# EasyEDA schematic LawnBot.json
TITLE: LawnBot Circuit Diagram; REV: 1.0; Date: 2025-03-28; Sheet: 1/1; Drawn By: Huy T Huong; Company: University of Bridgeport
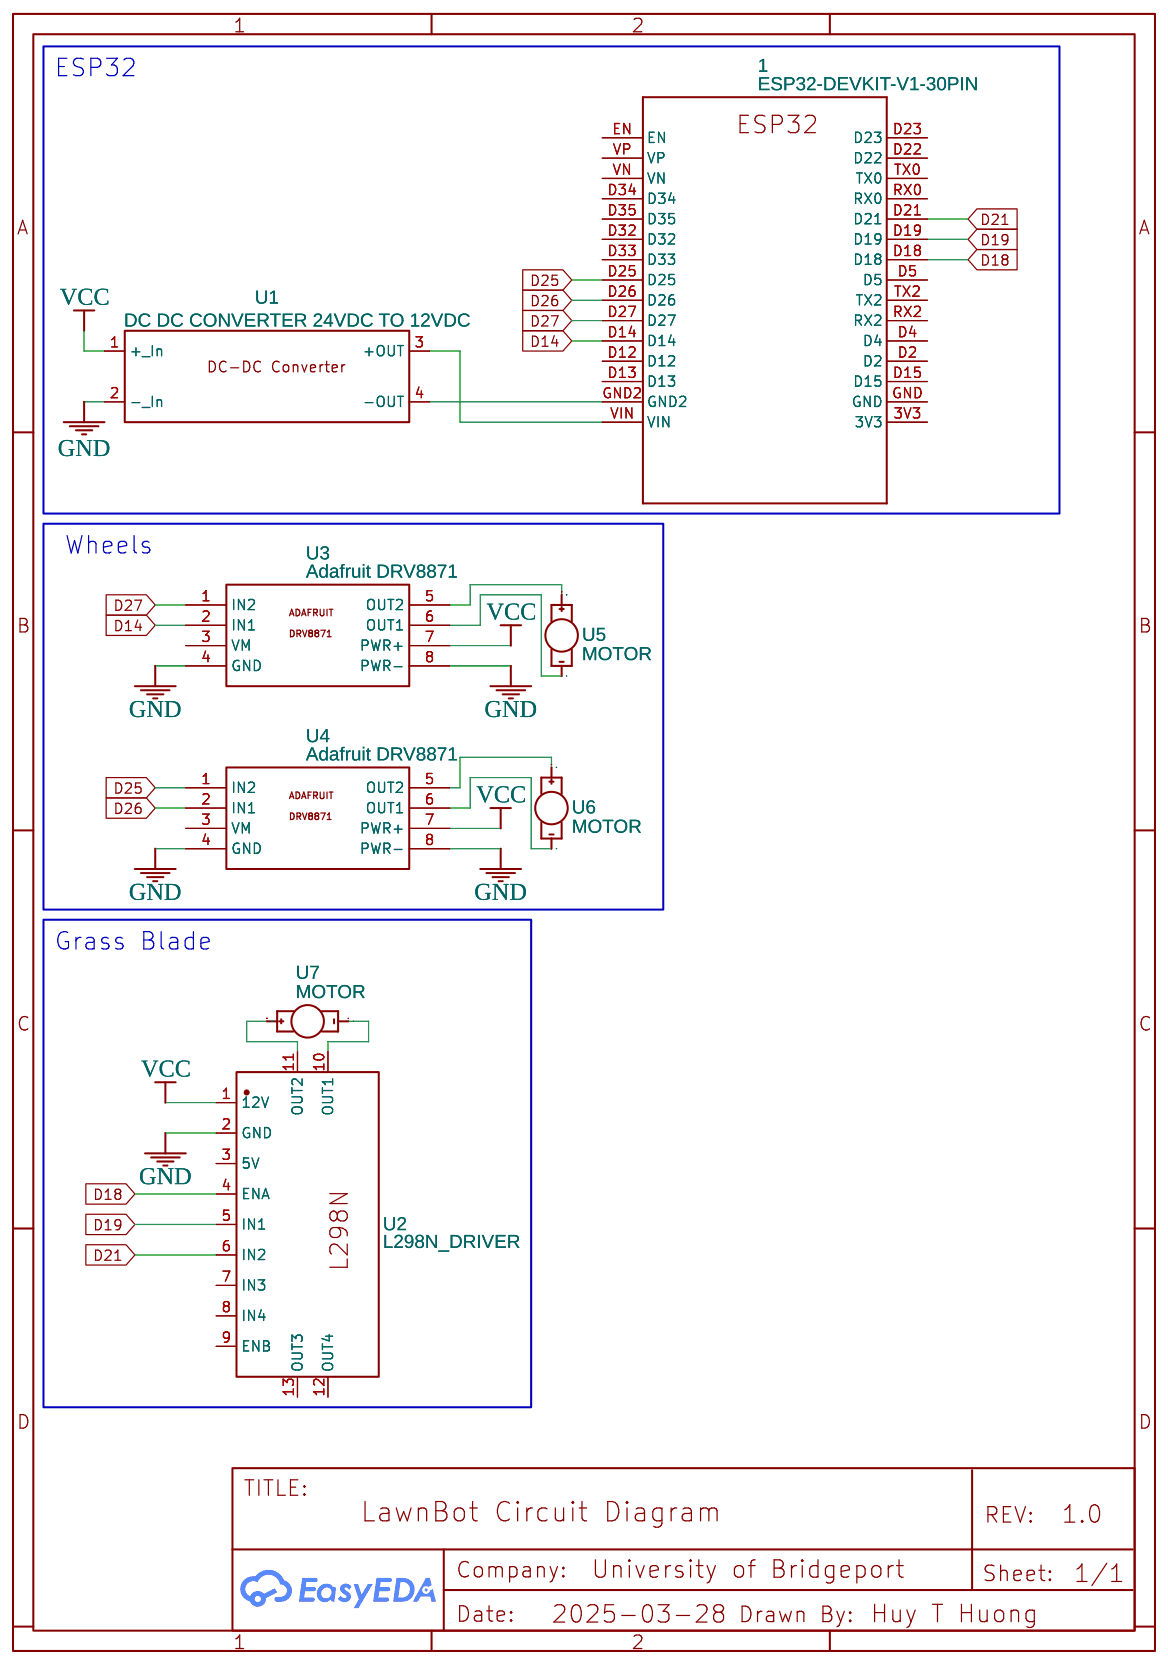
[diagram p0: schematic sheet]

## Parts
1  ESP32-DEVKIT-V1-30PIN  [ESP32-DEVKITV1_ESP32-DEVKITV1]
U1  DC DC CONVERTER 24VDC TO 12VDC  [3A-BUCK-CONVERTER]
U2  L298N_DRIVER  [L298N]
U3  Adafruit DRV8871  [ADAFRUIT DRV8871]
U4  Adafruit DRV8871  [ADAFRUIT DRV8871]
U5  MOTOR  [VIBE-MOTOR-10MM]
U6  MOTOR  [VIBE-MOTOR-10MM]
U7  MOTOR  [VIBE-MOTOR-10MM]

## Library data of the parts
1 = ESP32-DEVKIT-V1-30PIN: Contributor: petrawilliamleka
U1 = DC DC CONVERTER 24VDC TO 12VDC: Manufacturer: A; Manufacturer Part: A; Supplier Part: AB; link: A; Contributor: ashok_inverted
U2 = L298N_DRIVER: Supplier: LCSC; Contributor: vic
U3 U4 = Adafruit DRV8871: Manufacturer: Adafruit; Manufacturer Part: 3190; Supplier Part: 1528-1719-ND; Supplier: Digi-Key; Contributor: foxtechnica; Supplier 2: Mouser; Supplier 2 Part: 485-3190
U5-U7 = MOTOR: Contributor: SparkFun

## Nets
GND: U1.2(- In) U2.2(GND) U3.4(GND) U3.8(PWR-) U4.4(GND) U4.8(PWR-)
VCC: U1.1(+ In) U2.1(12V) U3.7(PWR+) U4.7(PWR+)
D14: 1.D14 U3.2(IN1)
D18: 1.D18 U2.4(ENA)
D19: 1.D19 U2.5(IN1)
D21: 1.D21 U2.6(IN2)
D25: 1.D25 U4.1(IN2)
D26: 1.D26 U4.2(IN1)
D27: 1.D27 U3.1(IN2)
Net-(1-GND2): 1.GND2 U1.4(-OUT)
Net-(1-VIN): 1.VIN U1.3(+OUT)
Net-(U2-10): U2.10(OUT1) U7.-
Net-(U2-11): U2.11(OUT2) U7.+
Net-(U3-5): U3.5(OUT2) U5.+
Net-(U3-6): U3.6(OUT1) U5.-
Net-(U4-5): U4.5(OUT2) U6.+
Net-(U4-6): U4.6(OUT1) U6.-

Not connected (* = marked no-connect by the designer): 1 3V3 D2 D4 D5 D12 D13 D15 D22 D23 D32 D33 D34 D35 EN GND RX0 RX2 TX0 TX2 VN VP; U2 3(5V) 7(IN3) 8(IN4) 9(ENB) 12(OUT4) 13(OUT3); U3 3(VM); U4 3(VM)

## Notes on the sheet
- ESP32
- Wheels
- Grass Blade
